# Altium schematic sheet main.SchDoc
size A
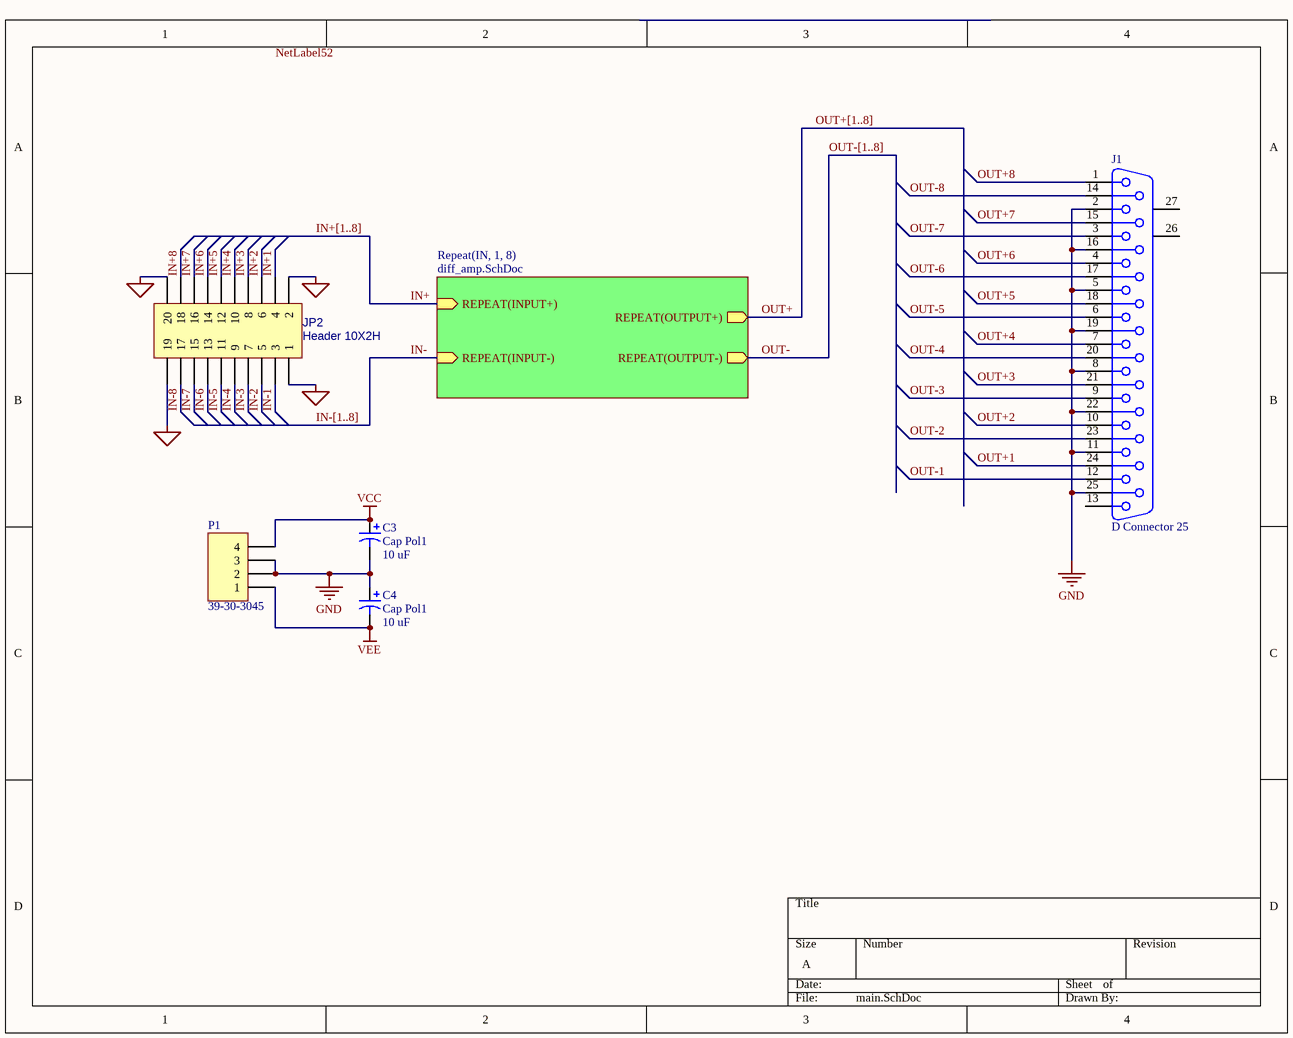
[diagram p0: main.SchDoc]

## Parts
C3  Cap Pol1  value 10 uF  [CAPPR5-5x5]
C4  Cap Pol1  value 10 uF  [CAPPR5-5x5]
J1  D Connector 25  [DSUB1.385-2H25A]
JP2  Header 10X2H  [HDR2X10]
P1  39-30-3045  [MJ4RTHR]

## Sub-sheets
Repeat(IN, 1, 8) = diff_amp.SchDoc: REPEAT(INPUT+) (in), REPEAT(INPUT-) (in), REPEAT(OUTPUT+) (out), REPEAT(OUTPUT-) (out)

## Nets
AGND: JP2.1 JP2.2 JP2.19 JP2.20
GND: C3.2 C4.1 J1.2 J1.5 J1.8 J1.11 J1.16 J1.19 J1.22 J1.25 P1.2 P1.3
VCC: C3.1 P1.4
VEE: C4.2 P1.1
IN+: sheet Repeat(IN, 1, 8)/REPEAT(INPUT+)
IN+1: JP2.4
IN+2: JP2.6
IN+3: JP2.8
IN+4: JP2.10
IN+5: JP2.12
IN+6: JP2.14
IN+7: JP2.16
IN+8: JP2.18
IN-: sheet Repeat(IN, 1, 8)/REPEAT(INPUT-)
IN-1: JP2.3
IN-2: JP2.5
IN-3: JP2.7
IN-4: JP2.9
IN-5: JP2.11
IN-6: JP2.13
IN-7: JP2.15
IN-8: JP2.17
OUT+: sheet Repeat(IN, 1, 8)/REPEAT(OUTPUT+)
OUT+1: J1.24
OUT+2: J1.10
OUT+3: J1.21
OUT+4: J1.7
OUT+5: J1.18
OUT+6: J1.4
OUT+7: J1.15
OUT+8: J1.1
OUT-: sheet Repeat(IN, 1, 8)/REPEAT(OUTPUT-)
OUT-1: J1.12
OUT-2: J1.23
OUT-3: J1.9
OUT-4: J1.20
OUT-5: J1.6
OUT-6: J1.17
OUT-7: J1.3
OUT-8: J1.14

Not connected (* = marked no-connect by the designer): J1 13 26(MH1) 27(MH2)

## Buses and harness runs
bus IN+[1..8]
bus IN-[1..8]
bus OUT+[1..8]
bus OUT-[1..8]

## Notes on the sheet
- Labels drawn without touching a wire or pin: NetLabel52

## Library data of the parts
C3 C4 = Cap Pol1: Polarized Capacitor (Radial); Published: 8-Jun-2000; LatestRevisionDate: 17-Jul-2002; LatestRevisionNote: Re-released for DXP Platform.; PackageReference: RB7.6-15; Publisher: Altium Limited
J1 = D Connector 25: Receptacle Assembly, 25 Position, Right Angle; PackageDocument: U; Positions: 25; Published: 15-Jun-2001; LatestRevisionDate: 17-Jul-2002; LatestRevisionNote: Re-released for DXP Platform.; DatasheetDocument: 19-Mar-1999; PackageReference: 787202; Publisher: Altium Limited; Orientation: Right Angle; Gender: Receptacle
JP2 = Header 10X2H: Header, 10-Pin, Dual row, Right Angle; Manufacturer: Generic Components; Class I: Connector; Revision: July-2002: Re-released for DXP Platform.; Publisher: Altium Limited
P1 = Header 4: Header, 4-Pin; LatestRevisionDate: 17-Jul-2002; LatestRevisionNote: Re-released for DXP Platform.; Publisher: Altium Limited